# EAGLE design SparkX_EZ_Header (EAGLE 9.6.2)
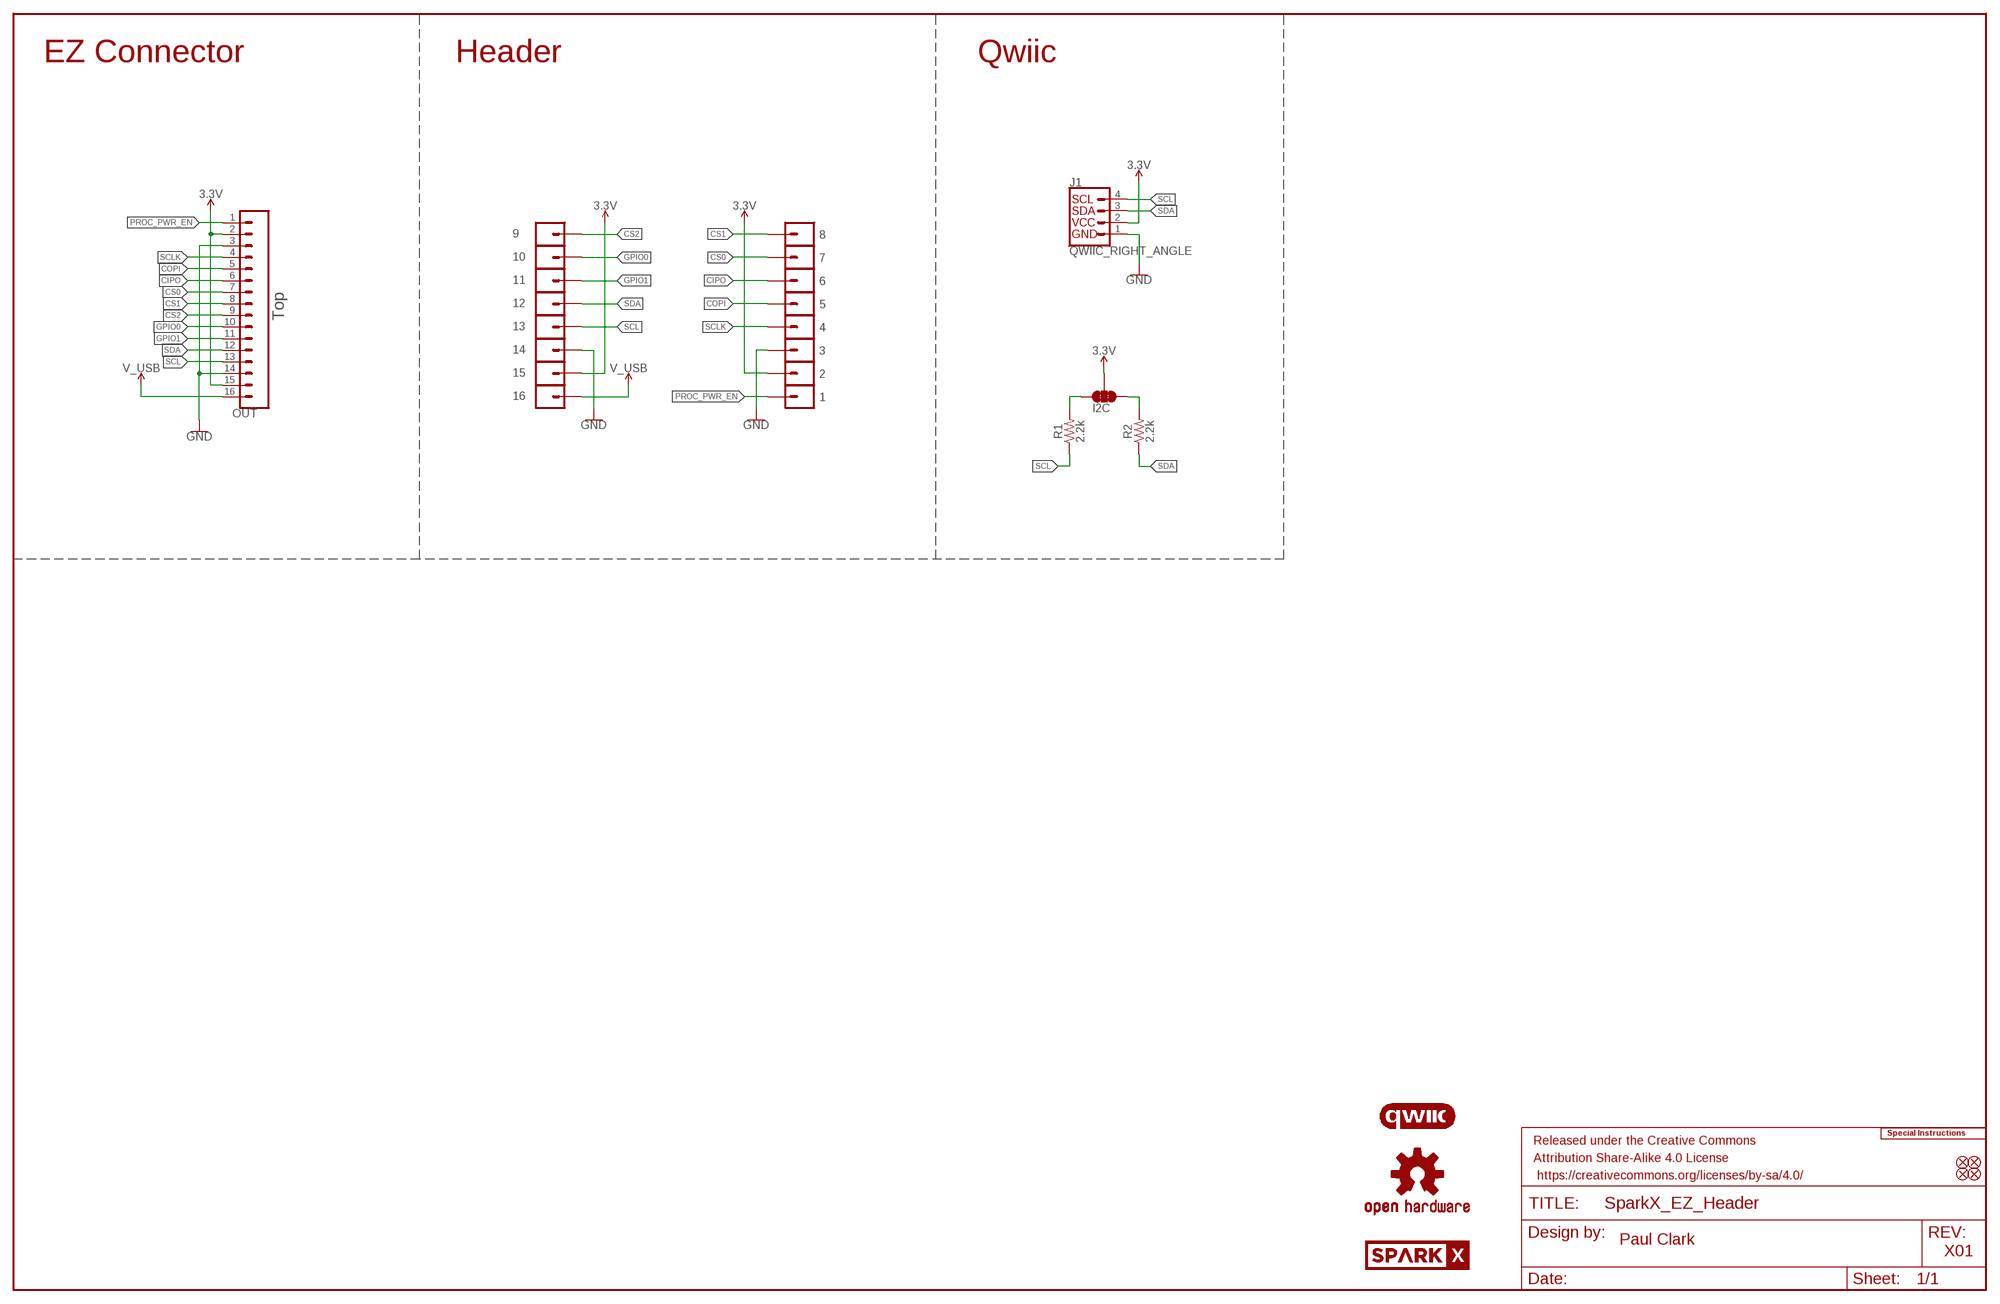
[diagram p0: schematic, sheet 1]

## Parts
1  CONN_01PTH_NO_SILK_YES_STOP  [1X01_NO_SILK]
2  CONN_01PTH_NO_SILK_YES_STOP  [1X01_NO_SILK]
3  CONN_01PTH_NO_SILK_YES_STOP  [1X01_NO_SILK]
4  CONN_01PTH_NO_SILK_YES_STOP  [1X01_NO_SILK]
5  CONN_01PTH_NO_SILK_YES_STOP  [1X01_NO_SILK]
6  CONN_01PTH_NO_SILK_YES_STOP  [1X01_NO_SILK]
7  CONN_01PTH_NO_SILK_YES_STOP  [1X01_NO_SILK]
8  CONN_01PTH_NO_SILK_YES_STOP  [1X01_NO_SILK]
9  CONN_01PTH_NO_SILK_YES_STOP  [1X01_NO_SILK]
10  CONN_01PTH_NO_SILK_YES_STOP  [1X01_NO_SILK]
11  CONN_01PTH_NO_SILK_YES_STOP  [1X01_NO_SILK]
12  CONN_01PTH_NO_SILK_YES_STOP  [1X01_NO_SILK]
13  CONN_01PTH_NO_SILK_YES_STOP  [1X01_NO_SILK]
14  CONN_01PTH_NO_SILK_YES_STOP  [1X01_NO_SILK]
15  CONN_01PTH_NO_SILK_YES_STOP  [1X01_NO_SILK]
16  CONN_01PTH_NO_SILK_YES_STOP  [1X01_NO_SILK]
FD1  FIDUCIALUFIDUCIAL  [FIDUCIAL-MICRO]
FD2  FIDUCIALUFIDUCIAL  [FIDUCIAL-MICRO]
FD3  FIDUCIALUFIDUCIAL  [FIDUCIAL-MICRO]
FD4  FIDUCIALUFIDUCIAL  [FIDUCIAL-MICRO]
FRAME1  FRAME-LEDGER  [CREATIVE_COMMONS]
I2C  JUMPER-SMT_3_2-NC_TRACE_SILK  [SMT-JUMPER_3_2-NC_TRACE_SILK]
J1  QWIIC_RIGHT_ANGLE  QWIIC_CONNECTORJS-1MM  [JST04_1MM_RA]
LOGO1  SPECIAL_INSTRUCTIONS-ORDERING  [ORDERING_INSTRUCTIONS]
LOGO2  OSHW-LOGOMINI  [OSHW-LOGO-MINI]
LOGO3  OSHW-LOGOMINI  [OSHW-LOGO-MINI]
LOGO4  QWIIC_LOGO_5MM  [QWIIC_5MM]
OUT  CONN_16FPC_16_0.5MM  [FPC_16_0.5MM]
R1  2.2k  2.2KOHM-0603-1/10W-1%  [0603]
R2  2.2k  2.2KOHM-0603-1/10W-1%  [0603]
U$1  SPARKX-LOGO3  [SPARKX-SMALL]

## Nets
3.3V: 2.1 15.1 I2C.2 J1.2 OUT.2 OUT.15
CIPO: 6.1 OUT.6
COPI: 5.1 OUT.5
CS0: 7.1 OUT.7
CS1: 8.1 OUT.8
CS2: 9.1 OUT.9
GND: 3.1 14.1 J1.1 OUT.3 OUT.14
GPIO0: 10.1 OUT.10
GPIO1: 11.1 OUT.11
N$1: I2C.3 R1.2
N$2: I2C.1 R2.2
PROC_PWR_EN: 1.1 OUT.1
SCL: 13.1 J1.4 OUT.13 R1.1
SCLK: 4.1 OUT.4
SDA: 12.1 J1.3 OUT.12 R2.1
V_USB: 16.1 OUT.16

## Notes on the sheet
- EZ Connector | Header | Qwiic
- Top
- Paul Clark
- X01

## Library data of the parts
1-16 = SparkFun-Connectors:CONN_01: Single connection point. Often used as Generic Header-pin footprint for 0.1 inch spaced/style header connections On any of the 0.1 inch spaced packages, you can populate with these: Break Away Headers - Straight <https://www.sparkfun.com/products/116> (PRT-00116) Break Away Male Headers - Right Angle <https://www.sparkfun.com/products/553> (PRT-00553) Female Headers <https://www.sparkfun.com/products/115> (PRT-00115) Break Away Headers - Machine Pin <https://www.sparkfun.com/products/117> (PRT-00117) Break Away Female Headers - Swiss Machine Pin <https://www.sparkfun.com/products/743> (PRT-00743) This device is also useful as a general connection point to wire up your design to another part of your project. Our various solder wires solder well into these plated through hole pads. Hook-Up Wire - Assortment (Stranded, 22 AWG) <https://www.sparkfun.com/products/11375> (PRT-11375) Hook-Up Wire - Assortment (Solid Core, 22 AWG) <https://www.sparkfun.com/products/11367> (PRT-11367) View the entire wire category on our website here <https://www.sparkfun.com/categories/141> Special notes: SMTSO-256-ET is a "flush mount" nut for a 4-40 screw. We mostly use this on specialty testbeds; it is a nice way to connect hardware to your PCB at an adjustable hieght. Also note, the SNAP packages are for using a snappable style connector. We sell a baggie of snaps and they are also used on two LilyPad designs: Snap Assortment - 30 pack (male and female) <https://www.sparkfun.com/products/11347> (DEV-11347) LilyPad Arduino SimpleSnap <https://www.sparkfun.com/products/10941> (DEV-10941) LilyPad SimpleSnap Protoboard <https://www.sparkfun.com/products/10940> (DEV-10940)
FD1-FD4 = SparkFun-Aesthetics:FIDUCIAL: Fiducial Alignment Points Point-of-reference for pick-and-place machines and other optical instruments.
FRAME1 = SparkFun-Aesthetics:FRAME-LEDGER: Schematic Frame - Ledger Standard 11x14 US Ledger frame
I2C = SparkFun-Jumpers:JUMPER-SMT_3_2-NC_TRACE: Normally closed trace jumper (2 of 2 connections) This jumper has a trace between all three pads so they are normally closed (NC). Use a razor knife to open the connection(s). For best results follow the IPC guidelines for cutting traces: Cutout at least 0.063 mm (0.005 in). Remove all loose material to clean up the cut area. Seal the cut with an approved epoxy. Reapply solder to reclose the connection(s).
J1 = SparkFun-Connectors:QWIIC_CONNECTOR: SparkFun I2C Standard Qwiic Connector An SMD 1mm pitch JST connector makes it easy and quick (get it? Qwiic?) to connect I2C devices to each other. The Qwiic system <http://www.sparkfun.com/qwiic> enables fast and solderless connection between popular platforms and various sensors and actuators. We carry 200mm <https://www.sparkfun.com/products/14204>, 100mm <https://www.sparkfun.com/products/14205>, 50mm <https://www.sparkfun.com/products/14206>, and breadboard friendly <https://www.sparkfun.com/products/14207> Qwiic cables. We also offer 10 pcs strips <https://www.sparkfun.com/products/14323> the SMD connectors.; PROD_ID: CONN-13694
LOGO1 = SparkFun-Aesthetics:SPECIAL_INSTRUCTIONS: Special Ordering/Production Instructions Alert Symbol for special PCB ordering instructions or unique production process warnings. Ordering Instructions Production Instructions Types of information that should be added to box: Copper weight Soldermask color Silk color PCB thickness Number of layers PCB Standard: 1.6mm FR4 1 oz copper immersion silver plating red soldermask white silkscreen Types of information that should be added to box: Special wash requirements Depaneling instructions Humidification Glue curing Default text settings: 0.07 inch 9% ratio 50% line distance
LOGO2 LOGO3 = SparkFun-Aesthetics:OSHW-LOGO: Open-Source Hardware (OSHW) Logo This logo indicates the piece of hardware it is found on incorporates a OSHW license and/or adheres to the definition of open source hardware found here: http://freedomdefined.org/OSHW
LOGO4 = SparkFun-Aesthetics:QWIIC_LOGO: Qwiic Logos for placement on schematic and PCB. The 5.5mm silk logo is best for placing next to Qwiic connector.
OUT = SparkFun-Connectors:CONN_16: Multi connection point. Often used as Generic Header-pin footprint for 0.1 inch spaced/style header connections On any of the 0.1 inch spaced packages, you can populate with these: Break Away Headers - Straight <https://www.sparkfun.com/products/116> (PRT-00116) Break Away Male Headers - Right Angle <https://www.sparkfun.com/products/553> (PRT-00553) Female Headers <https://www.sparkfun.com/products/115> (PRT-00115) Break Away Headers - Machine Pin <https://www.sparkfun.com/products/117> (PRT-00117) Break Away Female Headers - Swiss Machine Pin <https://www.sparkfun.com/products/743> (PRT-00743) For SCREWTERMINALS and SPRING TERMINALS visit here: Screw Terimnals on SparkFun.com <https://www.sparkfun.com/search/results?term=Screw+Terminals> (5mm/3.5mm/2.54mm spacing) This device is also useful as a general connection point to wire up your design to another part of your project. Our various solder wires solder well into these plated through hole pads. Hook-Up Wire - Assortment (Stranded, 22 AWG) <https://www.sparkfun.com/products/11375> (PRT-11375) Hook-Up Wire - Assortment (Solid Core, 22 AWG) <https://www.sparkfun.com/products/11367> (PRT-11367) View the entire wire category on our website here <https://www.sparkfun.com/categories/141> Special notes: Molex polarized connector foot print use with SKU : PRT-08231 with associated crimp pins and housings. 1MM SMD Version SKU: PRT-10208 NOTES ON THE VARIANTS LOCK and LOCK_LONGPADS... This footprint was designed to help hold the alignment of a through-hole component (i.e. 6-pin header) while soldering it into place. You may notice that each hole has been shifted either up or down by 0.005 of an inch from it's more standard position (which is a perfectly straight line). This slight alteration caused the pins (the squares in the middle) to touch the edges of the holes. Because they are alternating, it causes a "brace" to hold the component in place. 0.005 has proven to be the perfect amount of "off-center" position when using our standard breakaway headers. Although looks a little odd when you look at the bare footprint, once you have a header in there, the alteration is very hard to notice. Also,if you push a header all the way into place, it is covered up entirely on the bottom side.; PROD_ID: CONN-16066
R1 R2 = SparkFun-Resistors:2.2KOHM: 2.2kΩ resistor A resistor is a passive two-terminal electrical component that implements electrical resistance as a circuit element. Resistors act to reduce current flow, and, at the same time, act to lower voltage levels within circuits. - Wikipedia; PROD_ID: RES-08272
U$1 = SparkX:SPARKX-LOGO

## Net classes
1 Power: width 0.305 mm
2 3.3V: width 0.508 mm

## Board
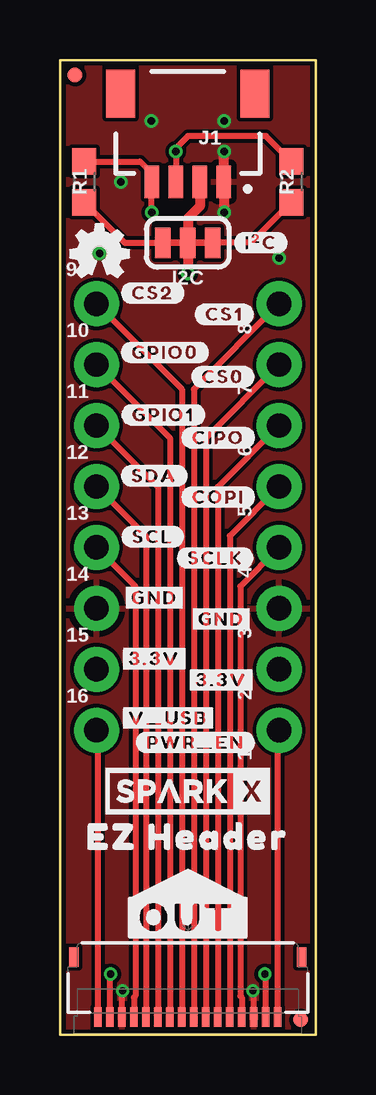
[diagram p1: board, top side]
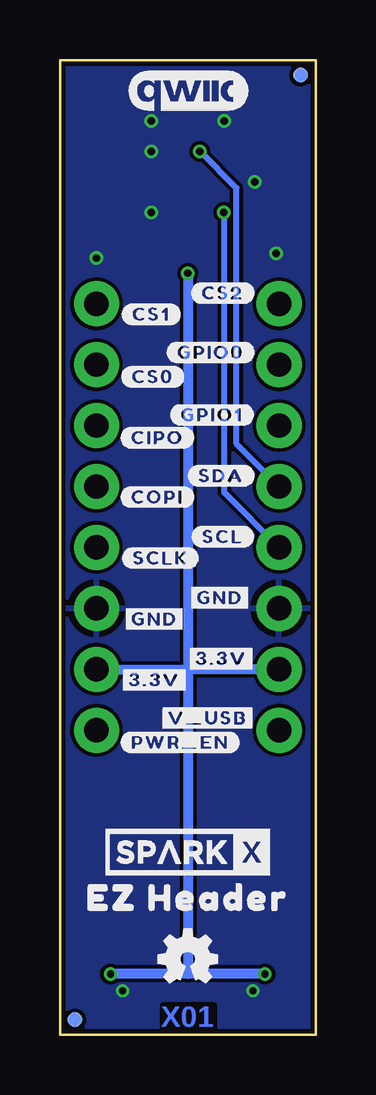
[diagram p2: board, bottom side, seen from below]

Size 10.67 x 40.64 mm. Coordinates in mm from the lower left corner, seen from the top.
Outline: 0,40.64 0,0 10.67,0 10.67,40.64 0,40.64
Copper layers (1*16): Top 0.035mm / dielectric 1.5mm / Bottom 0.035mm
Design rules "SparkFun-2-Layer-Minimum-JLCPCB": minimum track width 5mil, minimum drill 0.3mm, track to track 5mil, track to pad 5mil, pad to pad 5mil, via to via 5mil, smd to smd 5mil, copper to edge 7mil, drill to drill 7mil, minimum pad ring 5mil, minimum via ring 5mil, stop-mask expansion 2.5mil, vias tented up to drill 25mil, thermal gap 10mil

### Footprints (pad centres in the part's own frame; a part is rotated, then mirrored left to right if it is on the bottom)
1X01_NO_SILK = drill 1.016 pad 1.88: 1 0,0
FIDUCIAL-MICRO = smd 0.635 x 0.635: 1 0,0
SMT-JUMPER_3_2-NC_TRACE_SILK = smd 0.66 x 1.27: 1 -1.041,0; 2 0,0; 3 1.041,0
JST04_1MM_RA = smd 0.6 x 1.35: 1 -1.5,0; 2 -0.5,0; 3 0.5,0; 4 1.5,0 | smd 1.2 x 2: NC1 2.8,-3.675; NC2 -2.8,-3.675
FPC_16_0.5MM = smd 0.3 x 0.8: 1 -3.75,1.35; 2 -3.25,1.35; 3 -2.75,1.35; 4 -2.25,1.35; 5 -1.75,1.35; 6 -1.25,1.35; 7 -0.75,1.35; 8 -0.25,1.35; 9 0.25,1.35; 10 0.75,1.35; 11 1.25,1.35; 12 1.75,1.35; 13 2.25,1.35; 14 2.75,1.35; 15 3.25,1.35; 16 3.75,1.35 | smd 0.4 x 0.8: MP1 -4.75,-1.15; MP2 4.75,-1.15
0603 = smd 1.1 x 1: 1 -0.85,0; 2 0.85,0

### Placement (x,y rotation side)
1  9.14,12.7 90 top
2  9.14,15.24 90 top
3  9.14,17.78 90 top
4  9.14,20.32 90 top
5  9.14,22.86 90 top
6  9.14,25.4 90 top
7  9.14,27.94 90 top
8  9.14,30.48 90 top
9  1.52,30.48 0 top
10  1.52,27.94 0 top
11  1.52,25.4 0 top
12  1.52,22.86 0 top
13  1.52,20.32 0 top
14  1.52,17.78 0 top
15  1.52,15.24 0 top
16  1.52,12.7 0 top
FD1  0.64,40.01 0 top
FD2  0.64,40.01 0 bottom
FD3  10.03,0.64 0 top
FD4  10.03,0.64 0 bottom
FRAME1  45.72,-10.16 0 top  (outside the outline)
I2C  5.33,33.02 180 top
J1  5.33,35.56 180 top
LOGO1  19.05,50.8 0 top  (outside the outline)
LOGO2  1.65,32.58 0 top
LOGO3  5.33,3.17 0 bottom
LOGO4  5.33,39.37 0 bottom
OUT  5.33,2.1 180 top
R1  1.02,35.56 270 top
R2  9.65,35.56 270 top
U$1  5.33,10.16 0 top
U$2  [#3#3V#0]  3.94,15.68 0 top
U$3  [#V_USB#0]  4.51,13.21 0 top
U$4  [#3#3V#0]  6.73,14.8 0 top
U$5  [#PWR_EN#0]  5.65,12.19 0 top
U$6  [#GND#0]  6.73,17.34 0 top
U$7  [#GND#0]  3.94,18.22 0 top
U$8  [#SCLK#0]  6.48,19.88 0 top
U$9  [#SCL#0]  3.87,20.76 0 top
U$10  [#COPI#0]  6.6,22.42 0 top
U$11  [#SDA#0]  3.94,23.3 0 top
U$12  [#CIPO#0]  6.6,24.89 0 top
U$13  [#OUT#0]  5.33,4.89 0 top
U$14  [#GPIO1#0]  4.32,25.84 0 top
U$15  [#CS0#0]  6.79,27.43 0 top
U$16  [#GPIO0#0]  4.38,28.45 0 top
U$17  [#CS1#0]  6.86,30.04 0 top
U$18  [#CS2#0]  3.87,30.92 0 top
U$19  [#I�C#0]  8.38,33.02 0 top
U$20  SPARKX-LOGO3  [SPARKX-SMALL]  5.33,7.62 0 bottom
U$21  [EZ_HEADER0]  5.33,8.26 0 top
U$22  [#V_USB#0]  4.51,13.21 0 bottom
U$23  [#3#3V#0]  3.94,15.68 0 bottom
U$24  [#3#3V#0]  6.73,14.8 0 bottom
U$25  [#PWR_EN#0]  5.65,12.19 0 bottom
U$26  [#GND#0]  6.73,17.34 0 bottom
U$27  [#GND#0]  4,18.22 0 bottom
U$28  [#SCLK#0]  6.48,19.88 0 bottom
U$29  [#COPI#0]  6.6,22.42 0 bottom
U$30  [#SDA#0]  3.94,23.3 0 bottom
U$31  [#CIPO#0]  6.6,24.89 0 bottom
U$32  [#GPIO1#0]  4.32,25.84 0 bottom
U$33  [#CS0#0]  6.79,27.43 0 bottom
U$34  [#GPIO0#0]  4.38,28.45 0 bottom
U$35  [#CS1#0]  6.86,30.04 0 bottom
U$36  [#CS2#0]  3.87,30.92 0 bottom
U$37  [EZ_HEADER0]  5.33,5.71 0 bottom
U$38  [#SCL#0]  3.87,20.76 0 bottom

### Tracks (layer width: path | path; a pad name or v marks a point on that pad's centre or on a via)
3.3V  (via drill 0.3)
  Top 0.254: OUT.2 8.58,2.51 v8.55,2.54 | OUT.15 2.08,2.51 v2.12,2.54
  Top 0.406: v5.33,31.75 I2C.2 5.33,34.04 5.83,34.54 J1.2
  Bottom 0.406: 15.1 5.33,15.24 | 2.1 5.33,15.24 | v5.33,31.75 5.33,15.24 | v2.12,2.54 5.33,2.54 | 5.33,2.54 v8.55,2.54 | 5.33,15.24 5.33,2.54
CIPO
  Top 0.254: 6.1 6.58,22.84 OUT.6
COPI
  Top 0.254: 5.1 7.08,20.8 OUT.5
CS0
  Top 0.254: 7.1 6.08,24.88 OUT.7
CS1
  Top 0.254: 8.1 5.58,26.92 OUT.8
CS2
  Top 0.254: 9.1 5.08,26.92 OUT.9
GND  (via drill 0.3)
  Top 0.254: OUT.3 8.08,1.81 v8.05,1.84 | OUT.14 2.58,1.81 v2.62,1.84
  Top 0.406: v6.86,34.29 6.83,34.31 J1.1 6.83,36.81 v6.86,36.83
  other vias: 2.54,35.56 3.81,38.1 6.86,38.1 1.65,32.58 9.14,32.38
  pour Top (isolate 0.152, rank 3): 0,40.64 10.67,40.64 10.67,0 0,0
  pour Bottom (isolate 0.152, rank 2): 0,40.64 10.67,40.64 10.67,0 0,0
GPIO0
  Top 0.254: 10.1 4.58,24.88 OUT.10
GPIO1
  Top 0.254: 11.1 4.08,22.84 OUT.11
N$1
  Top 0.254: R1.2 2.71,33.02 I2C.3
N$2
  Top 0.254: R2.2 7.96,33.02 I2C.1
PROC_PWR_EN
  Top 0.254: OUT.1 9.08,12.64 1.1
SCL  (via drill 0.3)
  Top 0.254: OUT.13 3.08,1.56 3.15,1.62 3.15,18.7 13.1 | R1.1 3.34,36.41 3.83,35.92 J1.4 v3.83,34.29
  Bottom 0.254: 13.1 3.81,22.61 3.81,34.27 v3.83,34.29
SCLK
  Top 0.254: 4.1 7.52,18.7 7.52,1.62 7.58,1.56 OUT.4
SDA  (via drill 0.3)
  Top 0.254: 12.1 3.58,20.8 OUT.12 | R2.1 8.6,37.47 5.33,37.47 4.83,36.97 v4.83,36.83 J1.3
  Bottom 0.254: 12.1 3.3,24.64 3.3,35.3 v4.83,36.83
V_USB
  Top 0.254: OUT.16 1.58,12.64 16.1

### Text on the board
Bottom: X01
Measures: Dimensions in Inches
tDocu: 2-Layer Board / 1.6mm Thickness / 1oz Copper (Outer layers) / HASL Finish | Paul Clark